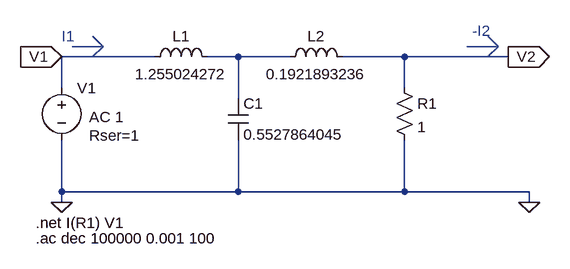
[diagram p0: schematic s11-s12.asc]
s11-s12.asc, the LTspice schematic file:
Version 4
SHEET 1 880 680
WIRE 128 -128 -16 -128
WIRE 256 -128 208 -128
WIRE 336 -128 256 -128
WIRE 512 -128 416 -128
WIRE 672 -128 512 -128
WIRE -16 -80 -16 -128
WIRE 512 -80 512 -128
WIRE 256 -64 256 -128
WIRE -16 80 -16 0
WIRE 256 80 256 0
WIRE 256 80 -16 80
WIRE 512 80 512 0
WIRE 512 80 256 80
WIRE 704 80 512 80
WIRE -16 96 -16 80
WIRE 704 96 704 80
FLAG 672 -128 V2
IOPIN 672 -128 Out
FLAG -16 -128 V1
IOPIN -16 -128 In
FLAG 704 96 0
FLAG -16 96 0
SYMBOL voltage -16 -96 R0
WINDOW 123 42 61 Left 2
WINDOW 39 42 89 Left 2
SYMATTR Value2 AC 1
SYMATTR SpiceLine Rser=1
SYMATTR InstName V1
SYMATTR Value ""
SYMBOL ind 112 -112 R270
WINDOW 0 32 56 VTop 2
WINDOW 3 5 56 VBottom 2
SYMATTR InstName L1
SYMATTR Value 1.255024272
SYMBOL ind 320 -112 R270
WINDOW 0 32 56 VTop 2
WINDOW 3 5 56 VBottom 2
SYMATTR InstName L2
SYMATTR Value 0.1921893236
SYMBOL cap 240 -64 R0
SYMATTR InstName C1
SYMATTR Value 0.5527864045
SYMBOL res 496 -96 R0
SYMATTR InstName R1
SYMATTR Value 1
TEXT -56 128 Left 2 !.net I(R1) V1
TEXT -56 152 Left 2 !.ac dec 100000 0.001 100
TEXT -16 -160 Left 2 ;I1
TEXT 616 -168 Left 2 ;-I2
LINE Normal 656 -144 608 -144
LINE Normal 640 -128 656 -144
LINE Normal 656 -144 640 -128
LINE Normal 640 -160 656 -144
LINE Normal 48 -144 0 -144
LINE Normal 32 -160 48 -144
LINE Normal 48 -144 32 -160
LINE Normal 32 -128 48 -144

The netlist it stands for:
* s11-s12.asc
V1 V1 0 AC 1 Rser=1
L1 V1 N001 1.255024272
L2 N001 V2 0.1921893236
C1 N001 0 0.5527864045
R1 V2 0 1
.net I(R1) V1
.ac dec 100000 0.001 100
* I1
* -I2
.backanno
.end